# EAGLE design challenge0.5 (EAGLE 6.0)
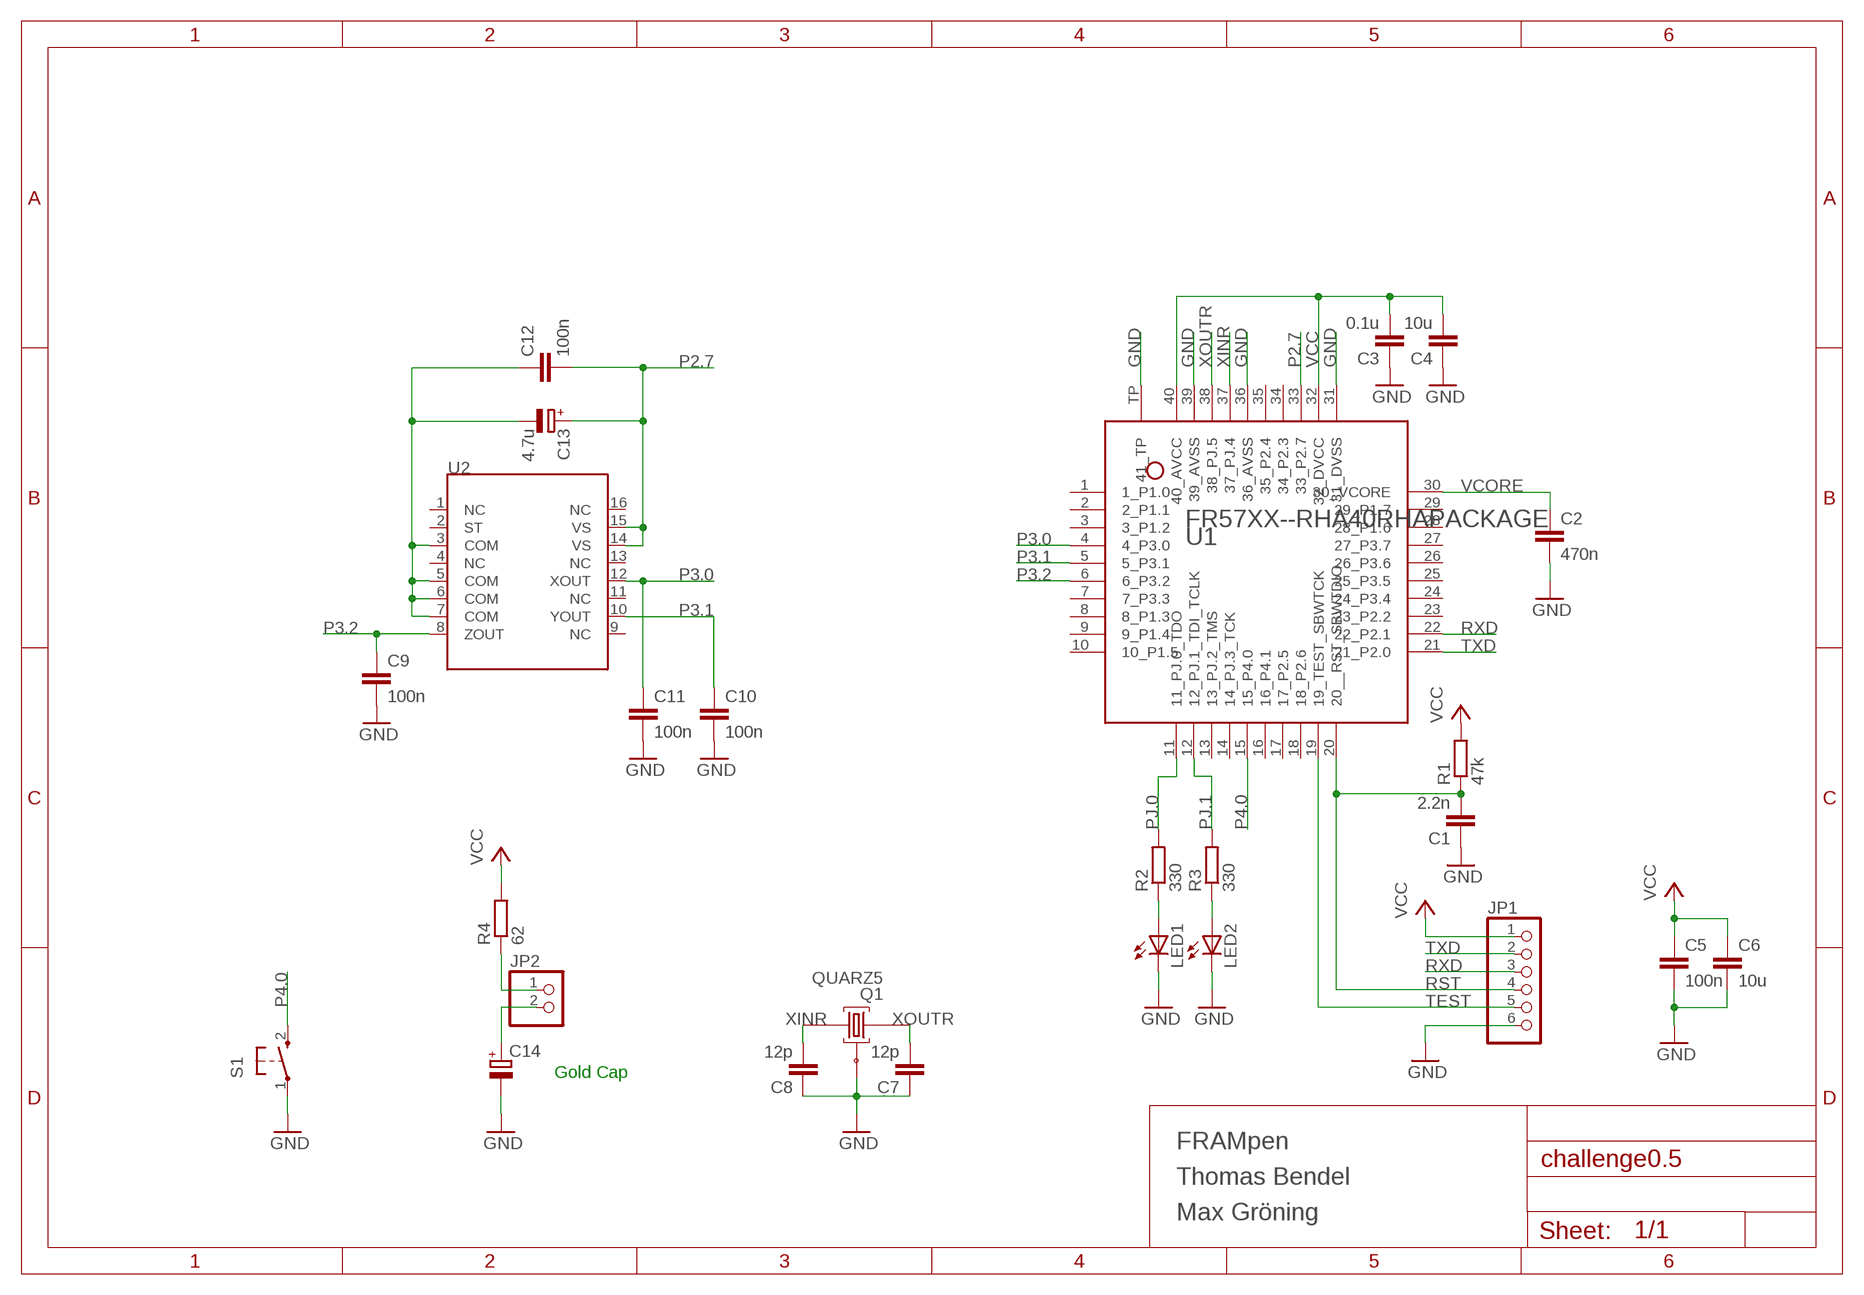
[diagram p0: schematic, sheet 1]

## Parts
C1  2.2n  C-EUC0805  [C0805]
C2  470n  C-EUC0805  [C0805]
C3  0.1u  C-EUC0805  [C0805]
C4  10u  C-EUC0805  [C0805]
C5  100n  C-EUC0805  [C0805]
C6  10u  C-EUC0805  [C0805]
C7  12p  C-EUC0805  [C0805]
C8  12p  C-EUC0805  [C0805]
C9  100n  C-EUC0805  [C0805]
C10  100n  C-EUC0805  [C0805]
C11  100n  C-EUC0805  [C0805]
C12  100n  C-EUC0805  [C0805]
C13  4.7u  CPOL-EUSMCA  [SMC_A]
C14  CPOL-EUE10-20  [EB20D]
JP1  PINHD-1X6/90  [1X06/90]
JP2  PINHD-1X2/90  [1X02/90]
LED1  LEDCHIP-LED0805  [CHIP-LED0805]
LED2  LEDCHIP-LED0805  [CHIP-LED0805]
Q1  QUARZ5  [QUARZ5]
R1  47k  R-EU_M0805  [M0805]
R2  330  R-EU_M0805  [M0805]
R3  330  R-EU_M0805  [M0805]
R4  62  R-EU_R1206  [R1206]
S1  PB  [PBTH]
U1  FR57XX--RHA40RHAPACKAGE  [RHA40]
U2  ADXL330  [RSA16]

## Nets
GND: C1.1 C2.2 C3.1 C4.1 C5.2 C6.2 C7.1 C8.1 C9.2 C10.2 C11.2 C14.- JP1.6 LED1.C LED2.C Q1.GND@0 S1.1(P) U1.31(31_DVSS) U1.36(36_AVSS) U1.39(39_AVSS) U1.TP(41_TP)
GOLDCAP+1: JP2.1 R4.1
GOLDCAP+2: C14.+ JP2.2
N$1: C12.1 C13.- U2.3(COM) U2.5(COM) U2.6(COM) U2.7(COM)
N$2: LED1.A R2.1
N$3: LED2.A R3.1
P2.7: C12.2 C13.+ U1.33(33_P2.7) U2.14(VS) U2.15(VS)
P3.0: C11.1 U1.4(4_P3.0) U2.12(XOUT)
P3.1: C10.1 U1.5(5_P3.1) U2.10(YOUT)
P3.2: C9.1 U1.6(6_P3.2) U2.8(ZOUT)
P4.0: S1.2(S) U1.15(15_P4.0)
PJ.0: R2.2 U1.11(11_PJ.0_TDO)
PJ.1: R3.2 U1.12(12_PJ.1_TDI_TCLK)
RST: C1.2 JP1.4 R1.1 U1.20(20__RST_SBWTDIO)
RXD: JP1.3 U1.22(22_P2.1)
TEST: JP1.5 U1.19(19_TEST_SBWTCK)
TXD: JP1.2 U1.21(21_P2.0)
VCC: C3.2 C4.2 C5.1 C6.1 JP1.1 R1.2 R4.2 U1.32(32_DVCC) U1.40(40_AVCC)
VCORE: C2.1 U1.30(30_VCORE)
XINR: C8.2 Q1.1 U1.37(37_PJ.4)
XOUTR: C7.2 Q1.2 U1.38(38_PJ.5)
Unconnected: U1.1(1_P1.0) U1.2(2_P1.1) U1.3(3_P1.2) U1.7(7_P3.3) U1.8(8_P1.3) U1.9(9_P1.4) U1.10(10_P1.5) U1.13(13_PJ.2_TMS) U1.14(14_PJ.3_TCK) U1.16(16_P4.1) U1.17(17_P2.5) U1.18(18_P2.6) U1.23(23_P2.2) U1.24(24_P3.4) U1.25(25_P3.5) U1.26(26_P3.6) U1.27(27_P3.7) U1.28(28_P1.6) U1.29(29_P1.7) U1.34(34_P2.3) U1.35(35_P2.4) U2.1(NC) U2.2(ST) U2.4(NC) U2.9(NC) U2.11(NC) U2.13(NC) U2.16(NC)

## Notes on the sheet
- Gold Cap
- FRAMpen
- Thomas Bendel
- Max Gröning

## Library data of the parts
C1-C12 = rcl:C-EU: CAPACITOR, European symbol
C13 C14 = rcl:CPOL-EU: POLARIZED CAPACITOR, European symbol
JP1 = pinhead:PINHD-1X6: PIN HEADER
JP2 = pinhead:PINHD-1X2: PIN HEADER
LED1 LED2 = led:LED: LED OSRAM: - CHIPLED LG R971, LG N971, LY N971, LG Q971, LY Q971, LO R971, LY R971 LH N974, LH R974 LS Q976, LO Q976, LY Q976 LO Q996 - Hyper CHIPLED LW Q18S LB Q993, LB Q99A, LB R99A - SideLED LS A670, LO A670, LY A670, LG A670, LP A670 LB A673, LV A673, LT A673, LW A673 LH A674 LY A675 LS A676, LA A676, LO A676, LY A676, LW A676 LS A679, LY A679, LG A679 - Hyper Micro SIDELED® LS Y876, LA Y876, LO Y876, LY Y876 LT Y87S - SmartLED LW L88C, LW L88S LB L89C, LB L89S, LG L890 LS L89K, LO L89K, LY L89K LS L896, LA L896, LO L896, LY L896 - TOPLED LS T670, LO T670, LY T670, LG T670, LP T670 LSG T670, LSP T670, LSY T670, LOP T670, LYG T670 LG T671, LOG T671, LSG T671 LB T673, LV T673, LT T673, LW T673 LH T674 LS T676, LA T676, LO T676, LY T676, LB T676, LH T676, LSB T676, LW T676 LB T67C, LV T67C, LT T67C, LS T67K, LO T67K, LY T67K, LW E67C LS E67B, LA E67B, LO E67B, LY E67B, LB E67C, LV E67C, LT E67C LW T67C LS T679, LY T679, LG T679 LS T770, LO T770, LY T770, LG T770, LP T770 LB T773, LV T773, LT T773, LW T773 LH T774 LS E675, LA E675, LY E675, LS T675 LS T776, LA T776, LO T776, LY T776, LB T776 LHGB T686 LT T68C, LB T68C - Hyper Mini TOPLED® LB M676 - Mini TOPLED Santana® LG M470 LS M47K, LO M47K, LY M47K Source: http://www.osram.convergy.de LUXEON: - LUMILED® LXK2-PW12-R00, LXK2-PW12-S00, LXK2-PW14-U00, LXK2-PW14-V00 LXK2-PM12-R00, LXK2-PM12-S00, LXK2-PM14-U00 LXK2-PE12-Q00, LXK2-PE12-R00, LXK2-PE12-S00, LXK2-PE14-T00, LXK2-PE14-U00 LXK2-PB12-K00, LXK2-PB12-L00, LXK2-PB12-M00, LXK2-PB14-N00, LXK2-PB14-P00, LXK2-PB14-Q00 LXK2-PR12-L00, LXK2-PR12-M00, LXK2-PR14-Q00, LXK2-PR14-R00 LXK2-PD12-Q00, LXK2-PD12-R00, LXK2-PD12-S00 LXK2-PH12-R00, LXK2-PH12-S00 LXK2-PL12-P00, LXK2-PL12-Q00, LXK2-PL12-R00 Source: www.luxeon.com KINGBRIGHT: KA-3528ASYC Source: www.kingbright.com
Q1 = sMSP430:QUARZ5
R1-R4 = rcl:R-EU_: RESISTOR, European symbol
S1 = electricalmeter:PB: OMRON SWITCH
U1 = TI_MSP430_v16_intern:FR57XX--RHA40: *** MSP430FR57xx *** 40-PIN RHA (QFN) ***
U2 = _5438_ATC:ADXL330

## Board
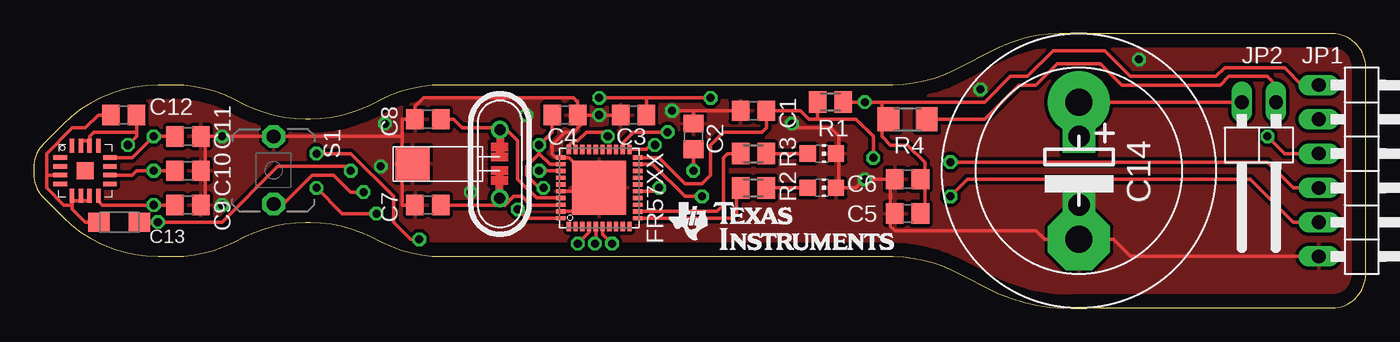
[diagram p1: board, top side]
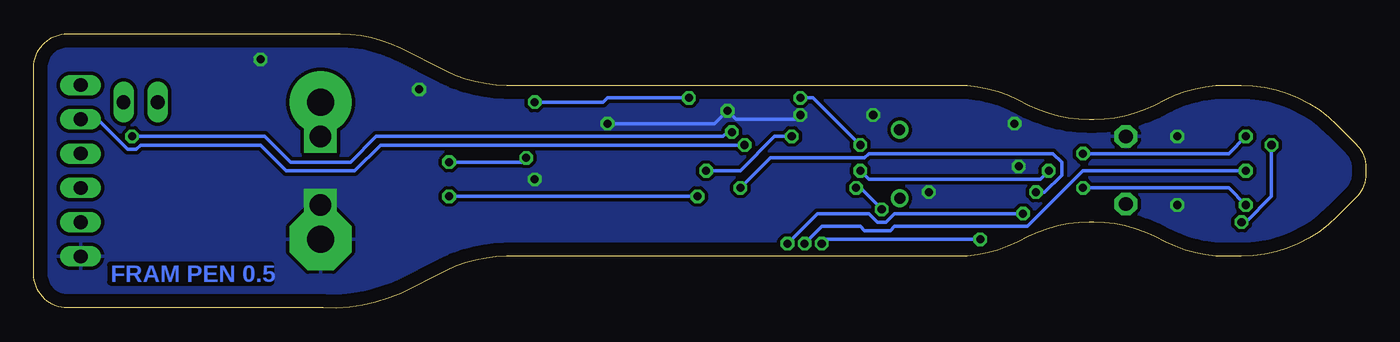
[diagram p2: board, bottom side, seen from below]

Size 98.73 x 20.32 mm. Coordinates in mm from the lower left corner, seen from the top.
Outline: 0,10.4 0,9.94 arc45 0.73,8.17 2.15,6.75 arc45 9.22,3.82 10.34,3.82 arc27 14.81,4.88 15.67,5.31 arc-27 20.14,6.36 20.5,6.36 arc-27 24.97,5.31 25.83,4.88 arc27 30.3,3.82 63.68,3.82 arc-27 68.15,2.77 71.55,1.07 arc27 77.29,0.01 96.23,0.01 arc90 98.73,2.51 98.73,17.82 arc90 96.23,20.32 76.02,20.32 arc27 71.55,19.27 68.15,17.57 arc-27 63.68,16.52 30.3,16.52 arc27 25.83,15.47 24.97,15.04 arc-27 20.5,13.98 20.14,13.98 arc-27 15.67,15.04 14.81,15.47 arc27 10.34,16.52 9.23,16.52 arc45 2.15,13.59 0.73,12.16 arc45 0,10.4
Copper layers (1*16): Top 0.035mm / dielectric 1.5mm / Bottom 0.035mm
Design rules: minimum track width 10mil, minimum drill 24mil, track to track 10mil, track to pad 10mil, pad to pad 10mil, via to via 10mil, smd to smd 10mil, copper to edge 40mil, drill to drill 8mil, minimum pad ring 10mil, minimum via ring 8mil, stop-mask expansion 4mil, vias tented up to drill 0mil, thermal gap 10mil

### Footprints (pad centres in the part's own frame; a part is rotated, then mirrored left to right if it is on the bottom)
C0805 = smd 1.3 x 1.5: 1 -0.95,0; 2 0.95,0
SMC_A = smd 1.6 x 1.4: + -1.5,0; - 1.5,0
EB20D = drill 2.007 pad 4.597: + -5.08,0 | drill 2.007 pad 4.597 octagon: - 5.08,0
1X06/90 = drill 1.016 long: 1 -6.35,-3.81; 2 -3.81,-3.81; 3 -1.27,-3.81; 4 1.27,-3.81; 5 3.81,-3.81; 6 6.35,-3.81
1X02/90 = drill 1.016 long: 1 -1.27,-3.81; 2 1.27,-3.81
CHIP-LED0805 = smd 1.2 x 1.2: A 0,-1.05; C 0,1.05
QUARZ5 = drill 0.813: 1 1.53,1.773; 2 1.52,-3.303 | smd 2.54 x 2.54: GND@0 -4.941,-0.762
M0805 = smd 1.3 x 1.6: 1 -0.95,0; 2 0.95,0
R1206 = smd 1.6 x 1.803: 1 -1.422,0; 2 1.422,0
PBTH = drill 1.016 pad 1.676 octagon: 1 -0.001,0.001; 2 5.001,0.001
RHA40 = smd 0.7 x 0.3: 1 -2.85,2.25; 2 -2.85,1.75; 3 -2.85,1.25; 4 -2.85,0.75; 5 -2.85,0.25; 6 -2.85,-0.25; 7 -2.85,-0.75; 8 -2.85,-1.25; 9 -2.85,-1.75; 10 -2.85,-2.25; 21 2.85,-2.25; 22 2.85,-1.75; 23 2.85,-1.25; 24 2.85,-0.75; 25 2.85,-0.25; 26 2.85,0.25; 27 2.85,0.75; 28 2.85,1.25; 29 2.85,1.75; 30 2.85,2.25 | smd 0.3 x 0.7: 11 -2.25,-2.85; 12 -1.75,-2.85; 13 -1.25,-2.85; 14 -0.75,-2.85; 15 -0.25,-2.85; 16 0.25,-2.85; 17 0.75,-2.85; 18 1.25,-2.85; 19 1.75,-2.85; 20 2.25,-2.85; 31 2.25,2.85; 32 1.75,2.85; 33 1.25,2.85; 34 0.75,2.85; 35 0.25,2.85; 36 -0.25,2.85; 37 -0.75,2.85; 38 -1.25,2.85; 39 -1.75,2.85; 40 -2.25,2.85 | smd 4 x 4: TP 0,0
RSA16 = smd 1.016 x 0.33: 1 -1.85,0.975; 2 -1.85,0.325; 3 -1.85,-0.325; 4 -1.85,-0.975; 9 1.85,-0.975; 10 1.85,-0.325; 11 1.85,0.325; 12 1.85,0.975 | smd 0.33 x 1.016: 5 -0.975,-1.85; 6 -0.325,-1.85; 7 0.325,-1.85; 8 0.975,-1.85; 13 0.975,1.85; 14 0.325,1.85; 15 -0.325,1.85; 16 -0.975,1.85 | smd 1.27 x 1.27: TP 0,0

### Placement (x,y rotation side)
C1  53.34,14.62 0 top
C2  48.89,12.71 90 top
C3  44.45,14.3 0 top
C4  39.37,14.3 180 top
C5  64.77,7 180 top
C6  64.77,9.54 180 top
C7  29.21,7.63 0 top
C8  29.21,13.98 0 top
C9  11.43,7.63 0 top
C10  11.43,10.17 0 top
C11  11.43,12.71 0 top
C12  6.67,14.3 0 top
C13  6.35,6.36 180 top
C14  77.47,10.17 270 top
JP1  99.06,10.17 270 top
JP2  90.81,11.44 180 top
LED1  58.42,8.9 270 top
LED2  58.42,11.44 270 top
Q1  33.02,11.44 0 top
R1  59.05,15.25 0 top
R2  53.34,8.9 180 top
R3  53.34,11.44 180 top
R4  64.77,13.98 180 top
S1  17.78,12.71 270 top
U1  41.91,8.9 90 top
U2  3.81,10.17 0 top
U$1  [LOGO16_TPLACE]  46.99,4.14 0 top

### Tracks (layer width: path | path; a pad name or v marks a point on that pad's centre or on a via)
GND  (via drill 0.6, 1.6)
  Top 0.254: C9.2 12.7,7.63 12.7,10.17 C10.2 12.7,10.49 12.7,12.71 C11.2 v13.97,12.71 S1.1 | S1.1 | Q1.GND@0 28.07,10.68 27.94,10.81 27.3,10.81 | 27.3,10.81 27.3,12.71 | 27.3,12.71 27.3,13.98 C8.1 | C7.1 27.3,7.63 27.3,10.81 | S1.1 | S1.1 | S1.1 27.3,12.71 | 40.32,13.98 40.64,14.3 | 40.64,14.3 40.64,13.66 40,13.03 39.37,13.03 38.42,12.08 38.42,11.44 38.71,11.15 U1.31 39.66,11.15 U1.TP | C8.1 | C8.1 28.26,14.93 28.89,15.57 40,15.57 40.32,15.25 40.32,13.98 | C4.1 40.32,13.98 | C3.1 v41.91,14.3 40.64,14.3 | U1.36 41.66,8.65 U1.TP | 63.5,7 63.5,9.54 C6.2 v61.59,9.54 60.96,8.9 59.69,8.9 | LED1.C 59.69,8.9 | 59.69,8.9 59.69,11.44 | C2.2 48.89,14.62 | 48.89,14.62 v47.31,14.62 | C1.1 48.89,14.62 | v77.47,7.63 C14.- | JP1.6 81.28,3.82 80.01,5.09 C14.- | C5.2 63.5,7 | 63.5,7 63.5,6.04 63.82,5.73 74.3,5.73 74.93,5.09 C14.- | LED2.C 59.69,11.44 | 59.69,11.44 59.69,12.71 59.05,13.35 56.51,13.35 v56.2,13.66 | U1.39 40.16,7.15 U1.TP
  Bottom 0.254: v41.91,14.3 42.23,13.98 46.67,13.98 v47.31,14.62 48.26,13.66 v56.2,13.66
  other vias: 13.97,7.63 36.51,14.3 70.17,16.2 81.92,18.43 26.04,13.66 25.72,10.49 32.38,8.58
  pour Top: -1.27,3.82 -1.27,20.97 94.62,20.97 99.06,20.97 99.06,3.19 99.06,-0.62 88.9,-0.62 -1.27,-0.62
  pour Bottom: -1.27,3.82 -1.27,20.97 8.26,20.97 99.06,20.97 99.06,10.17 99.06,-0.62 88.27,-0.62 -1.27,-0.62
GOLDCAP+1
  Top 0.254: R4.1 70.48,13.98 73.03,16.52 74.3,16.52 75.88,18.11 79.06,18.11 80.65,16.52 87.95,16.52 88.58,17.16 91.44,17.16 92.08,16.52 JP2.1
GOLDCAP+2  (via drill 1.6)
  Top 0.254: JP2.2 C14.+ v77.47,12.71
N$1
  Top 0.254: 1.96,9.85 0.95,9.85 | 0.95,9.85 0.95,11.44 2.86,13.35 3.81,13.35 4.76,14.3 C12.1 | U2.5 2.84,7.65 2.86,7.63 | 2.86,7.63 2.22,7.63 0.95,8.9 0.95,9.85 | C13.- 3.81,6.36 2.86,7.31 2.86,7.63 | U2.7 4.13,7.95 3.48,7.95 U2.6 3.49,8.31 3.49,7.95 2.86,7.95 2.86,7.63
  Top 0.305: U2.3 1.96,9.85
N$2
  Top 0.254: R2.1 LED1.A
N$3
  Top 0.254: R3.1 LED2.A
P2.7  (via drill 0.6)
  Top 0.254: U2.15 3.48,12.39 4.13,12.39 | U2.14 4.13,12.39 | 4.13,12.39 4.13,12.72 4.45,13.03 7.62,13.03 | C12.2 7.62,13.03 | 7.62,13.03 7.62,12.71 v6.99,12.08 | C13.+ v9.21,6.36 13.97,6.36 18.1,10.49 23.18,10.49 v23.5,10.17 | U1.33 38.75,10.15 38.73,10.17 v37.46,10.17
  Bottom 0.254: v6.99,12.08 6.99,8.27 8.89,6.36 v9.21,6.36 | v37.46,10.17 36.83,9.54 24.13,9.54 v23.5,10.17
P3.0  (via drill 0.6)
  Top 0.254: U2.12 6.03,11.15 6.03,11.12 7.3,11.12 v8.89,12.71 C11.1 | U1.4 41.16,5.61 v40.32,4.77 | v28.57,5.09 27.94,5.09 26.67,6.36 26.67,8.27 23.5,11.44 v20.96,11.44
  Bottom 0.254: v8.89,12.71 10.16,11.44 v20.96,11.44 | v40.32,4.77 40,5.09 v28.57,5.09
P3.1  (via drill 0.6)
  Top 0.254: U2.10 6.03,9.85 7.3,9.85 7.62,10.17 v8.89,10.17 C10.1 | U1.5 41.66,4.84 v41.59,4.77
  Bottom 0.254: v8.89,10.17 20.96,10.17 25.08,6.04 34.92,6.04 35.24,5.73 37.15,5.73 37.46,6.04 40.32,6.04 v41.59,4.77
P3.2  (via drill 0.6)
  Top 0.254: U2.8 4.79,7.97 4.76,7.95 5.08,7.63 v8.89,7.63 C9.1 | U1.6 42.16,5.48 v42.86,4.77 | v25.4,7 22.86,7 v20.96,8.9
  Bottom 0.254: v8.89,7.63 10.16,8.9 v20.96,8.9 | v42.86,4.77 40.64,7 36.83,7 36.2,6.36 35.56,6.36 34.92,7 v25.4,7
P4.0  (via drill 0.6)
  Top 0.254: S1.2 17.78,7.63 18.41,7.63 20.64,9.85 22.23,9.85 23.5,8.58 v24.45,8.58 | U1.15 46.1,8.65 v46.35,8.9
  Bottom 0.254: v24.45,8.58 23.81,8.58 22.54,9.85 22.54,10.81 23.18,11.44 36.83,11.44 37.15,11.12 44.13,11.12 v46.35,8.9
PJ.0
  Top 0.254: U1.11 51.72,6.65 52.07,7 52.07,8.9 R2.2
PJ.1
  Top 0.254: R3.2 51.43,11.44 51.12,11.12 51.12,7.63 50.64,7.15 U1.12
RST  (via drill 0.6)
  Top 0.254: JP1.4 93.34,8.9 91.44,10.81 v67.95,10.81 | v62.23,11.12 62.23,12.71 60.96,13.98 58.1,13.98 | R1.1 58.1,13.98 | U1.20 46.33,11.15 48.26,9.22 49.53,9.22 50.16,9.85 50.16,12.08 51.12,13.03 53.97,13.03 54.29,13.35 C1.2 56.83,14.62 57.47,13.98 58.1,13.98
  Bottom 0.254: v67.95,10.81 62.55,10.81 v62.23,11.12
RXD  (via drill 0.6)
  Top 0.254: U1.22 43.66,12.24 44.45,13.03 v46.99,13.03 | v91.44,12.71 92.71,11.44 JP1.3
  Bottom 0.254: v46.99,13.03 47.31,13.03 47.62,12.71 73.34,12.71 75.25,10.81 79.69,10.81 81.6,12.71 v91.44,12.71
TEST  (via drill 0.6)
  Top 0.254: U1.19 45.88,10.65 48.26,8.27 v49.53,8.27 | v67.95,8.27 69.22,9.54 90.17,9.54 93.34,6.36 JP1.5
  Bottom 0.254: v49.53,8.27 v67.95,8.27
TXD  (via drill 0.6)
  Top 0.254: U1.21 44.14,11.75 44.13,11.76 45.4,11.76 45.72,12.08 v46.04,12.08
  Bottom 0.254: v46.04,12.08 73.03,12.08 74.93,10.17 80.01,10.17 81.92,12.08 90.81,12.08 91.12,11.76 91.76,11.76 93.98,13.98 JP1.2
VCC  (via drill 0.6)
  Top 0.254: U1.32 38.25,10.65 37.46,11.44 | C4.2 38.42,13.98 38.42,13.03 v37.46,12.08 37.46,11.44 | C3.2 45.4,13.98 45.4,15.57 | 45.4,15.57 v41.91,15.57 | C5.1 66.04,7 66.04,9.22 C6.1 66.04,9.54 66.04,10.81 64.77,12.08 63.5,12.08 62.87,12.71 62.87,13.98 | R4.2 62.87,13.98 | 62.87,13.98 62.87,15.25 | 62.87,15.25 v61.59,15.25 R1.2 | U1.40 36.54,6.65 v35.88,7.31 | v37.78,8.9 37.46,8.9 36.51,9.85 36.51,10.49 37.46,11.44 | JP1.1 93.98,16.52 92.71,17.79 88.27,17.79 87.63,17.16 81.28,17.16 79.38,19.06 75.56,19.06 73.66,17.16 72.39,17.16 70.48,15.25 62.87,15.25 | 45.4,15.57 v50.16,15.57
  Bottom 0.254: v41.91,15.57 40.96,15.57 v37.46,12.08 | v35.88,7.31 37.46,8.9 v37.78,8.9 | v50.16,15.57 56.2,15.57 56.51,15.25 v61.59,15.25
VCORE  (via drill 0.6)
  Top 0.254: U1.30 39.66,12.05 40,12.39 40.32,12.39 40.96,13.03 42.23,13.03 v42.54,12.71 | v48.89,10.17 C2.1
  Bottom 0.254: v42.54,12.71 43.81,12.71 46.35,10.17 v48.89,10.17
XINR
  Top 0.254: C8.2 31.11,13.98 31.75,13.35 34.29,13.35 34.42,13.21 Q1.1 35.06,13.21 35.88,12.39 35.88,9.54 37.26,8.15 U1.37
XOUTR
  Top 0.254: C7.2 34.61,7.63 | 34.61,7.63 34.92,7.63 35.56,8.27 36.2,8.27 36.83,7.63 38.73,7.63 38.75,7.65 U1.38 | Q1.2 34.61,8.07 34.61,7.63

### Text on the board
Bottom: FRAM PEN 0.5
tPlace: FR57XX